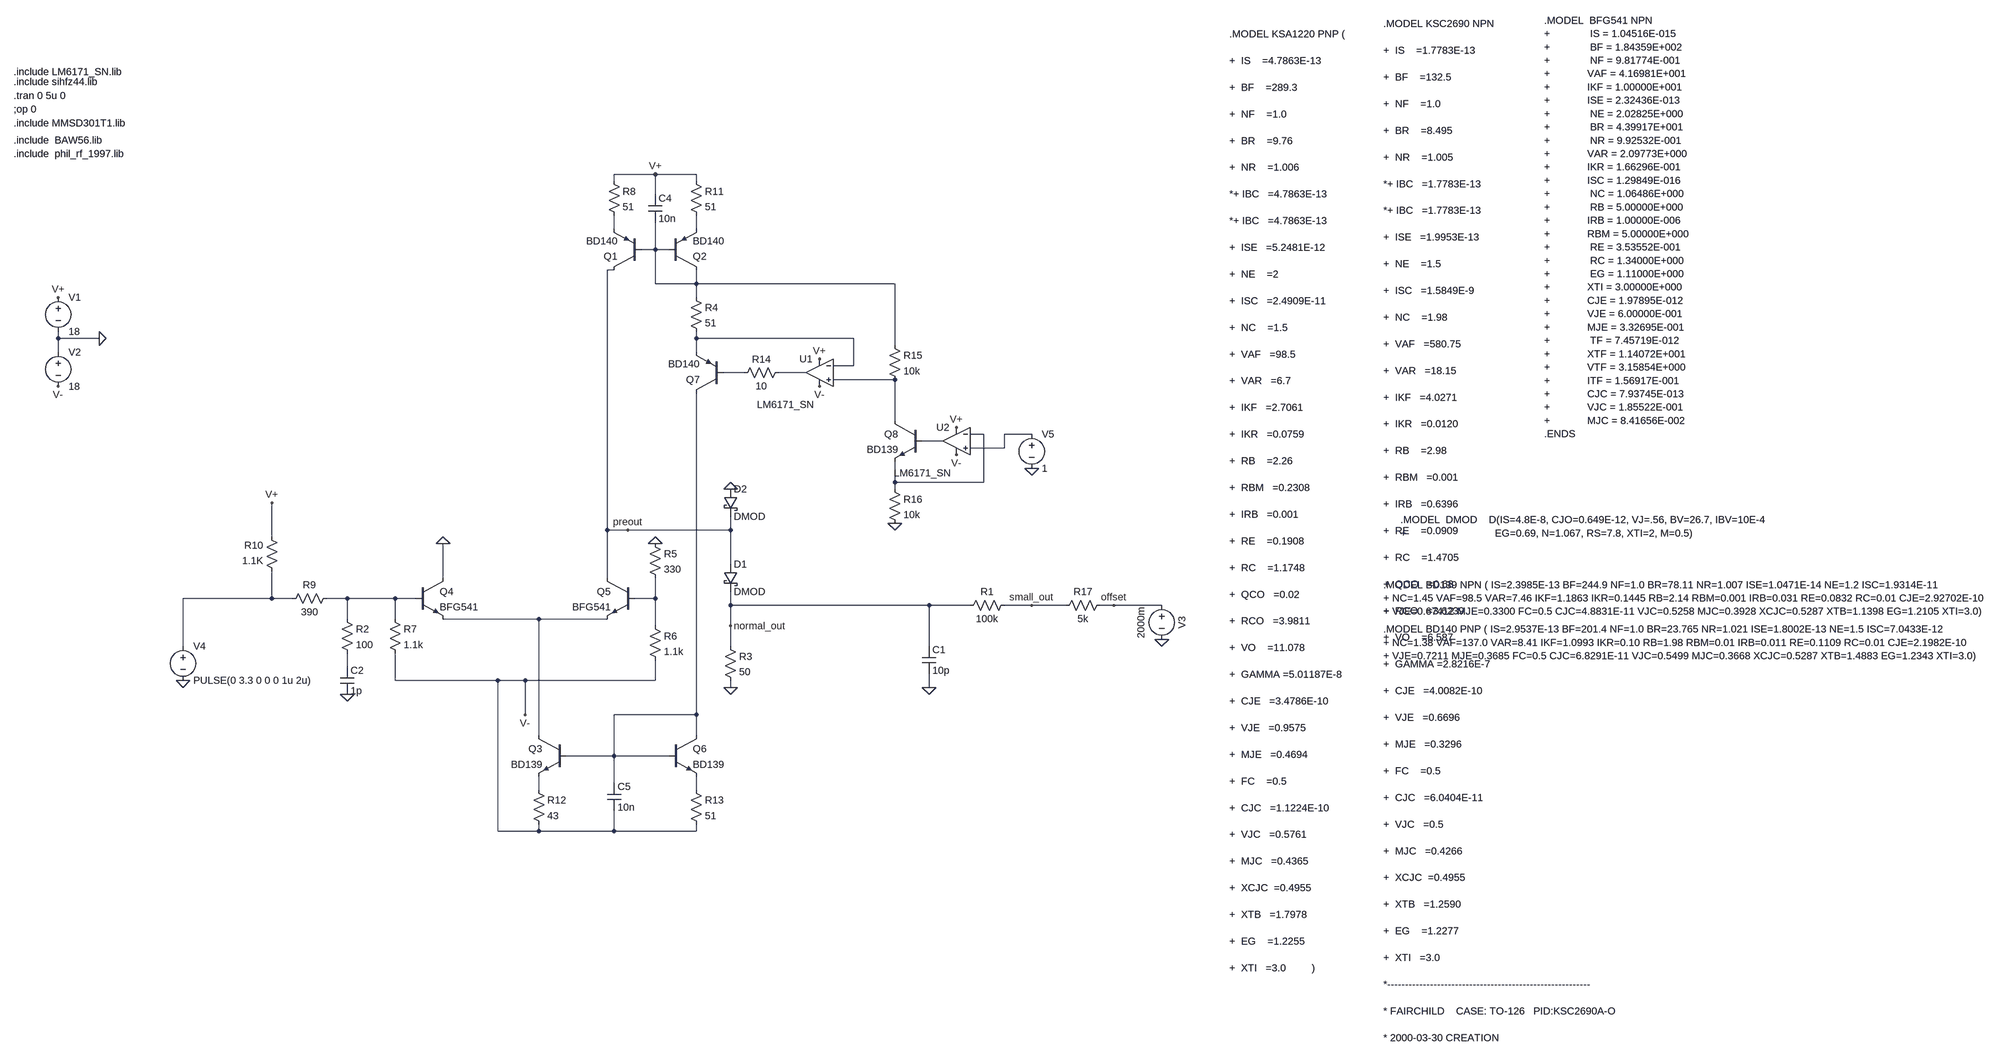
[diagram p0: schematic DC-DC_load _teoretical.asc]
DC-DC_load _teoretical.asc, the LTspice schematic file:
Version 4
SHEET 1 5924 1668
WIRE 1168 -64 1072 -64
WIRE 1264 -64 1168 -64
WIRE 1072 -48 1072 -64
WIRE 1264 -48 1264 -64
WIRE 1168 -16 1168 -64
WIRE 1072 64 1072 32
WIRE 1264 64 1264 32
WIRE 1168 112 1168 48
WIRE 1168 112 1136 112
WIRE 1200 112 1168 112
WIRE 1072 160 1056 160
WIRE 1168 192 1168 112
WIRE 1264 192 1264 160
WIRE 1264 192 1168 192
WIRE 1728 192 1264 192
WIRE 1264 224 1264 192
WIRE -336 320 -336 304
WIRE -240 320 -336 320
WIRE 1264 320 1264 304
WIRE 1632 320 1264 320
WIRE 1728 336 1728 192
WIRE -336 352 -336 320
WIRE 1264 352 1264 320
WIRE 1632 384 1632 320
WIRE 1632 384 1584 384
WIRE 1376 400 1328 400
WIRE 1520 400 1456 400
WIRE 1728 416 1584 416
WIRE 1728 512 1728 416
WIRE 1936 544 1904 544
WIRE 2048 544 1984 544
WIRE 1840 560 1792 560
WIRE 1984 576 1984 544
WIRE 1984 576 1904 576
WIRE 1728 656 1728 608
WIRE 1936 656 1936 544
WIRE 1936 656 1728 656
WIRE 1728 672 1728 656
WIRE 1056 768 1056 160
WIRE 1104 768 1056 768
WIRE 1344 768 1344 736
WIRE 1344 768 1104 768
WIRE 272 784 272 704
WIRE 1344 848 1344 768
WIRE 672 880 672 800
WIRE 1056 880 1056 768
WIRE 272 928 272 864
WIRE 272 928 64 928
WIRE 320 928 272 928
WIRE 448 928 400 928
WIRE 560 928 448 928
WIRE 608 928 560 928
WIRE 1168 928 1168 880
WIRE 1168 928 1120 928
WIRE 1344 944 1344 912
WIRE 1808 944 1344 944
WIRE 1904 944 1808 944
WIRE 2048 944 1984 944
WIRE 2128 944 2048 944
WIRE 2240 944 2208 944
WIRE 2352 944 2240 944
WIRE 448 976 448 928
WIRE 560 976 560 928
WIRE 896 976 672 976
WIRE 1056 976 896 976
WIRE 1168 992 1168 928
WIRE 1344 992 1344 944
WIRE 64 1040 64 928
WIRE 1344 1040 1344 992
WIRE 1808 1040 1808 944
WIRE 448 1088 448 1056
WIRE 560 1120 560 1056
WIRE 800 1120 560 1120
WIRE 864 1120 800 1120
WIRE 1168 1120 1168 1072
WIRE 1168 1120 864 1120
WIRE 1344 1136 1344 1120
WIRE 1808 1136 1808 1104
WIRE 864 1200 864 1120
WIRE 1264 1200 1264 448
WIRE 1264 1200 1072 1200
WIRE 896 1248 896 976
WIRE 1264 1248 1264 1200
WIRE 1072 1296 1072 1200
WIRE 1072 1296 960 1296
WIRE 1200 1296 1072 1296
WIRE 1072 1360 1072 1296
WIRE 896 1376 896 1344
WIRE 1264 1376 1264 1344
WIRE 800 1472 800 1120
WIRE 896 1472 896 1456
WIRE 896 1472 800 1472
WIRE 1072 1472 1072 1424
WIRE 1072 1472 896 1472
WIRE 1264 1472 1264 1456
WIRE 1264 1472 1072 1472
FLAG -240 320 0
FLAG -336 224 V+
FLAG -336 432 V-
FLAG 672 800 0
FLAG 1168 800 0
FLAG 864 1200 V-
FLAG 272 704 V+
FLAG 448 1152 0
FLAG 64 1120 0
FLAG 1344 1136 0
FLAG 1808 1136 0
FLAG 1344 672 0
FLAG 1168 -64 V+
FLAG 1344 992 normal_out
FLAG 1104 768 preout
FLAG 1552 432 V-
FLAG 1552 368 V+
FLAG 1872 528 V+
FLAG 1872 592 V-
FLAG 1728 752 0
FLAG 2048 624 0
FLAG 2048 944 small_out
FLAG 2352 1024 0
FLAG 2240 944 offset
DATAFLAG 464 928 ""
SYMBOL voltage -336 208 R0
WINDOW 123 0 0 Left 2
WINDOW 39 0 0 Left 2
SYMATTR InstName V1
SYMATTR Value 18
SYMBOL voltage -336 336 R0
WINDOW 123 0 0 Left 2
WINDOW 39 0 0 Left 2
SYMATTR InstName V2
SYMATTR Value 18
SYMBOL res 1328 1024 R0
SYMATTR InstName R3
SYMATTR Value 50
SYMBOL res 1152 784 R0
SYMATTR InstName R5
SYMATTR Value 330
SYMBOL res 1152 976 R0
SYMATTR InstName R6
SYMATTR Value 1.1k
SYMBOL res 544 960 R0
SYMATTR InstName R7
SYMATTR Value 1.1k
SYMBOL res 416 912 R90
WINDOW 0 0 56 VBottom 2
WINDOW 3 32 56 VTop 2
SYMATTR InstName R9
SYMATTR Value 390
SYMBOL res 288 880 R180
WINDOW 0 36 76 Left 2
WINDOW 3 36 40 Left 2
SYMATTR InstName R10
SYMATTR Value 1.1K
SYMBOL npn 608 880 R0
SYMATTR InstName Q4
SYMATTR Value BFG541
SYMBOL npn 1120 880 M0
SYMATTR InstName Q5
SYMATTR Value BFG541
SYMBOL res 432 960 R0
SYMATTR InstName R2
SYMATTR Value 100
SYMBOL cap 432 1088 R0
SYMATTR InstName C2
SYMATTR Value 1p
SYMBOL schottky 1328 848 R0
SYMATTR InstName D1
SYMATTR Value DMOD
SYMATTR Description Diode
SYMATTR Type diode
SYMBOL voltage 64 1024 R0
WINDOW 123 0 0 Left 0
WINDOW 39 0 0 Left 0
SYMATTR InstName V4
SYMATTR Value PULSE(0 3.3 0 0 0 1u 2u)
SYMBOL cap 1792 1040 R0
SYMATTR InstName C1
SYMATTR Value 10p
SYMBOL schottky 1328 672 R0
SYMATTR InstName D2
SYMATTR Value DMOD
SYMATTR Description Diode
SYMATTR Type diode
SYMBOL pnp 1136 160 R180
SYMATTR InstName Q1
SYMATTR Value BD140
SYMBOL pnp 1200 160 M180
SYMATTR InstName Q2
SYMATTR Value BD140
SYMBOL npn 960 1248 M0
SYMATTR InstName Q3
SYMATTR Value BD139
SYMBOL npn 1200 1248 R0
SYMATTR InstName Q6
SYMATTR Value BD139
SYMBOL res 1056 -64 R0
SYMATTR InstName R8
SYMATTR Value 51
SYMBOL res 1248 -64 R0
SYMATTR InstName R11
SYMATTR Value 51
SYMBOL res 880 1360 R0
SYMATTR InstName R12
SYMATTR Value 43
SYMBOL res 1248 1360 R0
SYMATTR InstName R13
SYMATTR Value 51
SYMBOL cap 1152 -16 R0
SYMATTR InstName C4
SYMATTR Value 10n
SYMBOL cap 1056 1360 R0
SYMATTR InstName C5
SYMATTR Value 10n
SYMBOL res 1248 208 R0
SYMATTR InstName R4
SYMATTR Value 51
SYMBOL Opamps\\opamp2 1552 336 M0
WINDOW 3 12 139 Left 2
SYMATTR Value LM6171_SN
SYMATTR InstName U1
SYMBOL res 1472 384 R90
WINDOW 0 0 56 VBottom 2
WINDOW 3 32 56 VTop 2
SYMATTR InstName R14
SYMATTR Value 10
SYMBOL pnp 1328 448 R180
SYMATTR InstName Q7
SYMATTR Value BD140
SYMBOL res 1712 320 R0
SYMATTR InstName R15
SYMATTR Value 10k
SYMBOL Opamps\\opamp2 1872 496 M0
WINDOW 3 12 139 Left 2
SYMATTR Value LM6171_SN
SYMATTR InstName U2
SYMBOL npn 1792 512 M0
SYMATTR InstName Q8
SYMATTR Value BD139
SYMBOL res 1712 656 R0
SYMATTR InstName R16
SYMATTR Value 10k
SYMBOL voltage 2048 528 R0
WINDOW 123 0 0 Left 0
WINDOW 39 0 0 Left 0
SYMATTR InstName V5
SYMATTR Value 1
SYMBOL res 2000 928 R90
WINDOW 0 0 56 VBottom 2
WINDOW 3 32 56 VTop 2
SYMATTR InstName R1
SYMATTR Value 100k
SYMBOL voltage 2352 928 R0
WINDOW 0 32 56 VTop 2
WINDOW 3 -32 56 VBottom 2
WINDOW 123 0 0 Left 0
WINDOW 39 0 0 Left 0
SYMATTR InstName V3
SYMATTR Value 2000m
SYMBOL res 2224 928 R90
WINDOW 0 0 56 VBottom 2
WINDOW 3 32 56 VTop 2
SYMATTR InstName R17
SYMATTR Value 5k
TEXT -440 -216 Left 2 !;op 0
TEXT -440 -304 Left 2 !.include LM6171_SN.lib
TEXT -440 -248 Left 2 !.tran 0 5u 0
TEXT -440 -280 Left 2 !.include sihfz44.lib
TEXT 4160 -392 Left 2 !.MODEL KSA1220 PNP ( \n\n+  IS    =4.7863E-13      \n\n+  BF    =289.3\n\n+  NF    =1.0 \n\n+  BR    =9.76\n\n+  NR    =1.006\n\n*+ IBC   =4.7863E-13\n\n*+ IBC   =4.7863E-13\n\n+  ISE   =5.2481E-12\n\n+  NE    =2\n\n+  ISC   =2.4909E-11\n\n+  NC    =1.5\n\n+  VAF   =98.5\n\n+  VAR   =6.7\n\n+  IKF   =2.7061\n\n+  IKR   =0.0759\n\n+  RB    =2.26\n\n+  RBM   =0.2308\n\n+  IRB   =0.001\n\n+  RE    =0.1908\n\n+  RC    =1.1748\n\n+  QCO   =0.02\n\n+  RCO   =3.9811\n\n+  VO    =11.078\n\n+  GAMMA =5.01187E-8\n\n+  CJE   =3.4786E-10\n\n+  VJE   =0.9575\n\n+  MJE   =0.4694\n\n+  FC    =0.5\n\n+  CJC   =1.1224E-10\n\n+  VJC   =0.5761\n\n+  MJC   =0.4365\n\n+  XCJC  =0.4955   \n\n+  XTB   =1.7978    \n\n+  EG    =1.2255 \n\n+  XTI   =3.0         )
TEXT 4520 -416 Left 2 !.MODEL KSC2690 NPN\n\n+  IS    =1.7783E-13      \n\n+  BF    =132.5\n\n+  NF    =1.0 \n\n+  BR    =8.495\n\n+  NR    =1.005\n\n*+ IBC   =1.7783E-13 \n\n*+ IBC   =1.7783E-13 \n\n+  ISE   =1.9953E-13\n\n+  NE    =1.5\n\n+  ISC   =1.5849E-9\n\n+  NC    =1.98\n\n+  VAF   =580.75\n\n+  VAR   =18.15\n\n+  IKF   =4.0271\n\n+  IKR   =0.0120\n\n+  RB    =2.98\n\n+  RBM   =0.001\n\n+  IRB   =0.6396\n\n+  RE    =0.0909\n\n+  RC    =1.4705\n\n+  QCO   =0.68\n\n+  RCO   =3.6239\n\n+  VO    =6.587\n\n+  GAMMA =2.8216E-7\n\n+  CJE   =4.0082E-10\n\n+  VJE   =0.6696\n\n+  MJE   =0.3296\n\n+  FC    =0.5\n\n+  CJC   =6.0404E-11\n\n+  VJC   =0.5\n\n+  MJC   =0.4266\n\n+  XCJC  =0.4955   \n\n+  XTB   =1.2590    \n\n+  EG    =1.2277 \n\n+  XTI   =3.0         \n\n*---------------------------------------------------------\n\n* FAIRCHILD    CASE: TO-126   PID:KSC2690A-O\n\n* 2000-03-30 CREATION
TEXT 4560 744 Left 2 !.MODEL  DMOD    D(IS=4.8E-8, CJO=0.649E-12, VJ=.56, BV=26.7, IBV=10E-4\n+                               EG=0.69, N=1.067, RS=7.8, XTI=2, M=0.5)
TEXT -440 -184 Left 2 !.include MMSD301T1.lib
TEXT -440 -144 Left 2 !.include  BAW56.lib
TEXT -440 -112 Left 2 !.include  phil_rf_1997.lib
TEXT 4896 -424 Left 2 !.MODEL  BFG541 NPN\n+              IS = 1.04516E-015\n+              BF = 1.84359E+002\n+              NF = 9.81774E-001\n+             VAF = 4.16981E+001\n+             IKF = 1.00000E+001\n+             ISE = 2.32436E-013\n+              NE = 2.02825E+000\n+              BR = 4.39917E+001\n+              NR = 9.92532E-001\n+             VAR = 2.09773E+000\n+             IKR = 1.66296E-001\n+             ISC = 1.29849E-016\n+              NC = 1.06486E+000\n+              RB = 5.00000E+000\n+             IRB = 1.00000E-006\n+             RBM = 5.00000E+000\n+              RE = 3.53552E-001\n+              RC = 1.34000E+000\n+              EG = 1.11000E+000\n+             XTI = 3.00000E+000\n+             CJE = 1.97895E-012\n+             VJE = 6.00000E-001\n+             MJE = 3.32695E-001\n+              TF = 7.45719E-012\n+             XTF = 1.14072E+001\n+             VTF = 3.15854E+000\n+             ITF = 1.56917E-001\n+             CJC = 7.93745E-013\n+             VJC = 1.85522E-001\n+             MJC = 8.41656E-002\n.ENDS
TEXT 4520 896 Left 2 !.MODEL BD139 NPN ( IS=2.3985E-13 BF=244.9 NF=1.0 BR=78.11 NR=1.007 ISE=1.0471E-14 NE=1.2 ISC=1.9314E-11\n+ NC=1.45 VAF=98.5 VAR=7.46 IKF=1.1863 IKR=0.1445 RB=2.14 RBM=0.001 IRB=0.031 RE=0.0832 RC=0.01 CJE=2.92702E-10\n+ VJE=0.67412 MJE=0.3300 FC=0.5 CJC=4.8831E-11 VJC=0.5258 MJC=0.3928 XCJC=0.5287 XTB=1.1398 EG=1.2105 XTI=3.0)
TEXT 4520 1000 Left 2 !.MODEL BD140 PNP ( IS=2.9537E-13 BF=201.4 NF=1.0 BR=23.765 NR=1.021 ISE=1.8002E-13 NE=1.5 ISC=7.0433E-12\n+ NC=1.38 VAF=137.0 VAR=8.41 IKF=1.0993 IKR=0.10 RB=1.98 RBM=0.01 IRB=0.011 RE=0.1109 RC=0.01 CJE=2.1982E-10\n+ VJE=0.7211 MJE=0.3685 FC=0.5 CJC=6.8291E-11 VJC=0.5499 MJC=0.3668 XCJC=0.5287 XTB=1.4883 EG=1.2343 XTI=3.0)

The netlist it stands for:
* DC-DC_load _teoretical.asc
V1 V+ 0 18
V2 0 V- 18
R3 normal_out 0 50
R5 0 N013 330
R6 N013 V- 1.1k
R7 N012 V- 1.1k
R9 N012 N011 390
R10 N011 V+ 1.1K
Q4 0 N012 N014 0 BFG541
Q5 preout N013 N014 0 BFG541
R2 N012 N015 100
C2 N015 0 1p
D1 preout normal_out DMOD
V4 N011 0 PULSE(0 3.3 0 0 0 1u 2u)
C1 normal_out 0 10p
D2 0 preout DMOD
Q1 preout N003 N001 0 BD140
Q2 N003 N003 N002 0 BD140
Q3 N014 N016 N017 0 BD139
Q6 N016 N016 N018 0 BD139
R8 V+ N001 51
R11 V+ N002 51
R12 N017 V- 43
R13 N018 V- 51
C4 V+ N003 10n
C5 N016 V- 10n
R4 N003 N004 51
XU1 N007 N004 V+ V- N006 LM6171_SN  ; pins In+ In- V+ V- OUT
R14 N006 N005 10
Q7 N016 N005 N004 0 BD140
R15 N003 N007 10k
XU2 N009 N008 V+ V- N010 LM6171_SN  ; pins In+ In- V+ V- OUT
Q8 N007 N010 N008 0 BD139
R16 N008 0 10k
V5 N009 0 1
R1 small_out normal_out 100k
V3 offset 0 2000m
R17 offset small_out 5k
.model D D
.lib standard.dio
.model NPN NPN
.model PNP PNP
.lib standard.bjt
;op 0
.include LM6171_SN.lib
.tran 0 5u 0
.include sihfz44.lib
.MODEL KSA1220 PNP (
+  IS    =4.7863E-13
+  BF    =289.3
+  NF    =1.0
+  BR    =9.76
+  NR    =1.006
*+ IBC   =4.7863E-13
*+ IBC   =4.7863E-13
+  ISE   =5.2481E-12
+  NE    =2
+  ISC   =2.4909E-11
+  NC    =1.5
+  VAF   =98.5
+  VAR   =6.7
+  IKF   =2.7061
+  IKR   =0.0759
+  RB    =2.26
+  RBM   =0.2308
+  IRB   =0.001
+  RE    =0.1908
+  RC    =1.1748
+  QCO   =0.02
+  RCO   =3.9811
+  VO    =11.078
+  GAMMA =5.01187E-8
+  CJE   =3.4786E-10
+  VJE   =0.9575
+  MJE   =0.4694
+  FC    =0.5
+  CJC   =1.1224E-10
+  VJC   =0.5761
+  MJC   =0.4365
+  XCJC  =0.4955
+  XTB   =1.7978
+  EG    =1.2255
+  XTI   =3.0         )
.MODEL KSC2690 NPN
+  IS    =1.7783E-13
+  BF    =132.5
+  NF    =1.0
+  BR    =8.495
+  NR    =1.005
*+ IBC   =1.7783E-13
*+ IBC   =1.7783E-13
+  ISE   =1.9953E-13
+  NE    =1.5
+  ISC   =1.5849E-9
+  NC    =1.98
+  VAF   =580.75
+  VAR   =18.15
+  IKF   =4.0271
+  IKR   =0.0120
+  RB    =2.98
+  RBM   =0.001
+  IRB   =0.6396
+  RE    =0.0909
+  RC    =1.4705
+  QCO   =0.68
+  RCO   =3.6239
+  VO    =6.587
+  GAMMA =2.8216E-7
+  CJE   =4.0082E-10
+  VJE   =0.6696
+  MJE   =0.3296
+  FC    =0.5
+  CJC   =6.0404E-11
+  VJC   =0.5
+  MJC   =0.4266
+  XCJC  =0.4955
+  XTB   =1.2590
+  EG    =1.2277
+  XTI   =3.0
*---------------------------------------------------------
* FAIRCHILD    CASE: TO-126   PID:KSC2690A-O
* 2000-03-30 CREATION
.MODEL  DMOD    D(IS=4.8E-8, CJO=0.649E-12, VJ=.56, BV=26.7, IBV=10E-4
+                               EG=0.69, N=1.067, RS=7.8, XTI=2, M=0.5)
.include MMSD301T1.lib
.include  BAW56.lib
.include  phil_rf_1997.lib
.MODEL  BFG541 NPN
+              IS = 1.04516E-015
+              BF = 1.84359E+002
+              NF = 9.81774E-001
+             VAF = 4.16981E+001
+             IKF = 1.00000E+001
+             ISE = 2.32436E-013
+              NE = 2.02825E+000
+              BR = 4.39917E+001
+              NR = 9.92532E-001
+             VAR = 2.09773E+000
+             IKR = 1.66296E-001
+             ISC = 1.29849E-016
+              NC = 1.06486E+000
+              RB = 5.00000E+000
+             IRB = 1.00000E-006
+             RBM = 5.00000E+000
+              RE = 3.53552E-001
+              RC = 1.34000E+000
+              EG = 1.11000E+000
+             XTI = 3.00000E+000
+             CJE = 1.97895E-012
+             VJE = 6.00000E-001
+             MJE = 3.32695E-001
+              TF = 7.45719E-012
+             XTF = 1.14072E+001
+             VTF = 3.15854E+000
+             ITF = 1.56917E-001
+             CJC = 7.93745E-013
+             VJC = 1.85522E-001
+             MJC = 8.41656E-002
.ENDS
.MODEL BD139 NPN ( IS=2.3985E-13 BF=244.9 NF=1.0 BR=78.11 NR=1.007 ISE=1.0471E-14 NE=1.2 ISC=1.9314E-11
+ NC=1.45 VAF=98.5 VAR=7.46 IKF=1.1863 IKR=0.1445 RB=2.14 RBM=0.001 IRB=0.031 RE=0.0832 RC=0.01 CJE=2.92702E-10
+ VJE=0.67412 MJE=0.3300 FC=0.5 CJC=4.8831E-11 VJC=0.5258 MJC=0.3928 XCJC=0.5287 XTB=1.1398 EG=1.2105 XTI=3.0)
.MODEL BD140 PNP ( IS=2.9537E-13 BF=201.4 NF=1.0 BR=23.765 NR=1.021 ISE=1.8002E-13 NE=1.5 ISC=7.0433E-12
+ NC=1.38 VAF=137.0 VAR=8.41 IKF=1.0993 IKR=0.10 RB=1.98 RBM=0.01 IRB=0.011 RE=0.1109 RC=0.01 CJE=2.1982E-10
+ VJE=0.7211 MJE=0.3685 FC=0.5 CJC=6.8291E-11 VJC=0.5499 MJC=0.3668 XCJC=0.5287 XTB=1.4883 EG=1.2343 XTI=3.0)
.backanno
.end